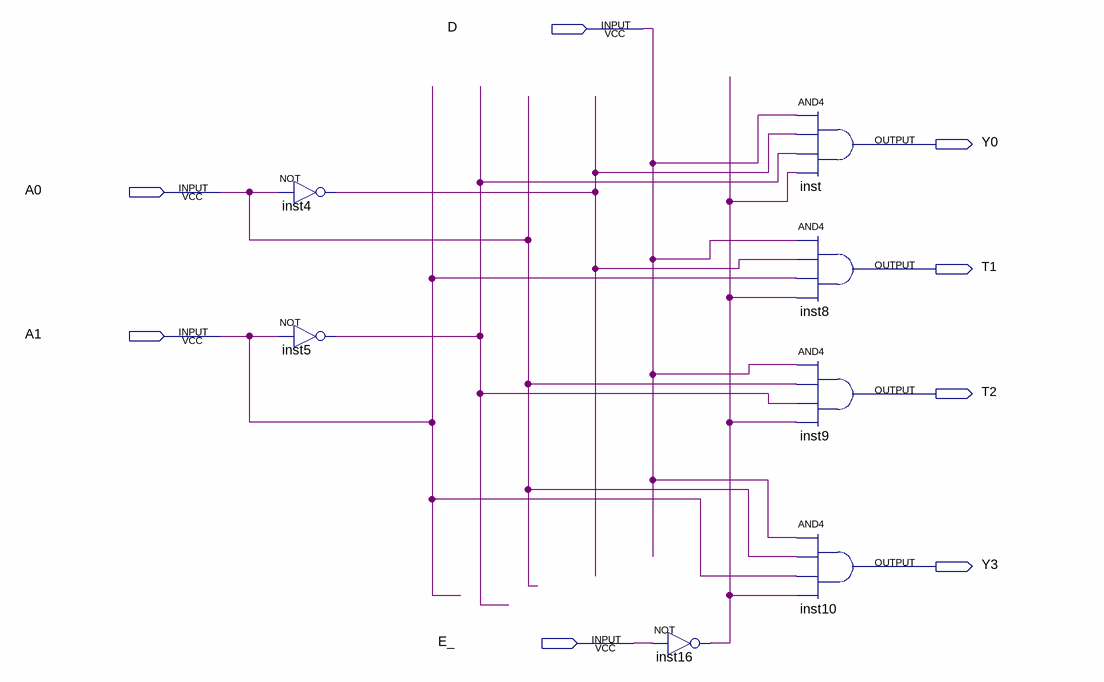
[diagram p0: schematic sheet]
// Quartus schematic yifensi.bdf as structural Verilog: 7 symbols, 8 pins
module yifensi (
  input  D,
  input  A0,
  input  A1,
  input  E_,
  output Y0,
  output T1,
  output T2,
  output Y3
);

  wire inst4_out, inst5_out, inst16_out;

  not inst4 (inst4_out, A0);
  not inst5 (inst5_out, A1);
  not inst16 (inst16_out, E_);
  and inst (Y0, D, inst4_out, inst5_out, inst16_out);
  and inst8 (T1, D, inst4_out, A1, inst16_out);
  and inst9 (T2, D, A0, inst5_out, inst16_out);
  and inst10 (Y3, D, A0, A1, inst16_out);
endmodule
